# Altium project Nebula_1.7OLED.PrjPcb
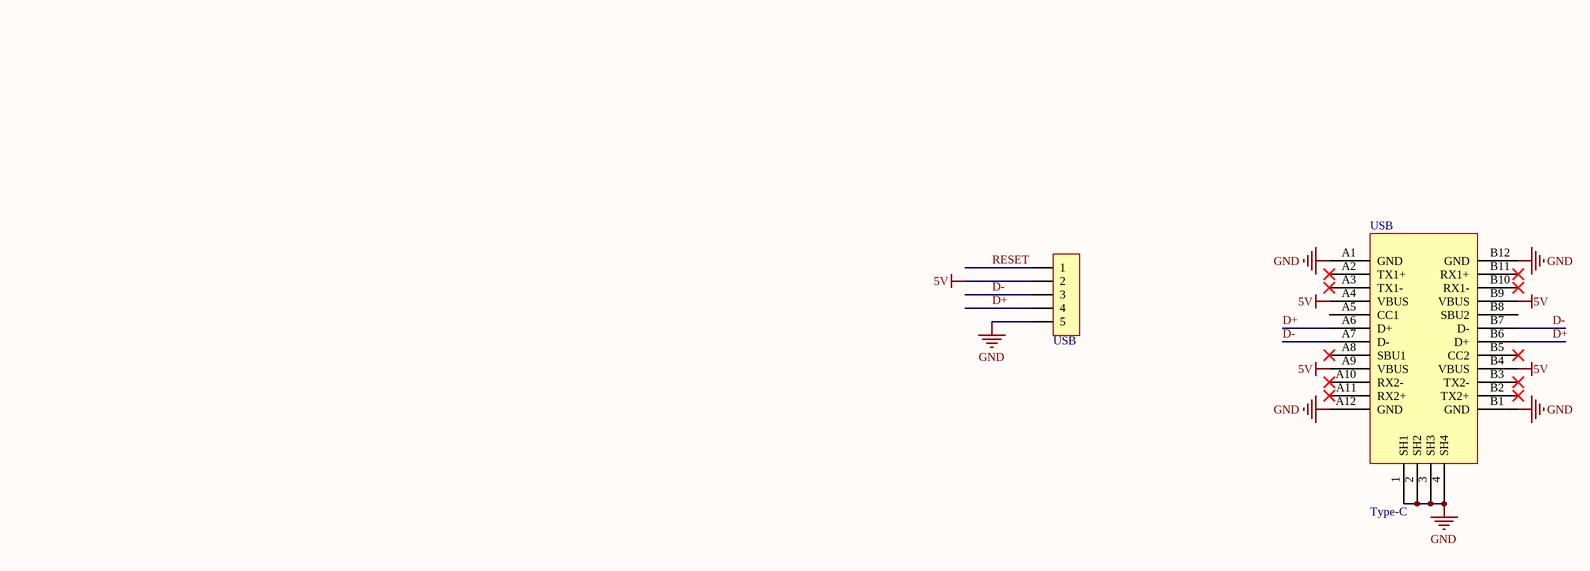
[diagram p0: USB Typec.SchDoc]
2 sheets, 38 parts. Net scope: global (net labels, ports and power ports of the same name join across sheets).
Board file: Nebula_1.7OLED.PcbDoc
Sheets:
  USB Typec.SchDoc
  Nebula_1.7OLED.SchDoc

## Sheet USB Typec.SchDoc
size A3; DocumentNumber: 1; SheetNumber: 1; SheetTotal: 2

### Parts
(Parts that share a designator on the sheet are numbered #1, #2 ... from top to bottom, then left to right.)
USB#1  HDR-1X5  [ZH1.5-LS-5P]  (value not drawn)
USB#2  Type-C  [Type-C]

### Nets
5V: USB#1.2 USB#2.A4(VBUS) USB#2.A9(VBUS) USB#2.B4(VBUS) USB#2.B9(VBUS)
GND: USB#1.5 USB#2.1(SH1) USB#2.2(SH2) USB#2.3(SH3) USB#2.4(SH4) USB#2.A1(GND) USB#2.A12(GND) USB#2.B1(GND) USB#2.B12(GND)
D+: USB#1.4 USB#2.A6(D+) USB#2.B6(D+)
D-: USB#1.3 USB#2.A7(D-) USB#2.B7(D-)
RESET: USB#1.1  [project net NRST]

Not connected (* = marked no-connect by the designer): USB#2 A2(TX1+)* A3(TX1-)* A5(CC1) A8(SBU1)* A10(RX2-)* A11(RX2+)* B2(TX2+)* B3(TX2-)* B5(CC2)* B8(SBU2) B10(RX1-)* B11(RX1+)*

### Library data of the parts
USB#1 = Header 5: 5P接插件; 版权归属: 源创客; BOM名称: 5P接插件; 学习资源: www.ooocke.com

## Sheet Nebula_1.7OLED.SchDoc
size A3; DocumentNumber: 1; SheetNumber: 1; SheetTotal: 1
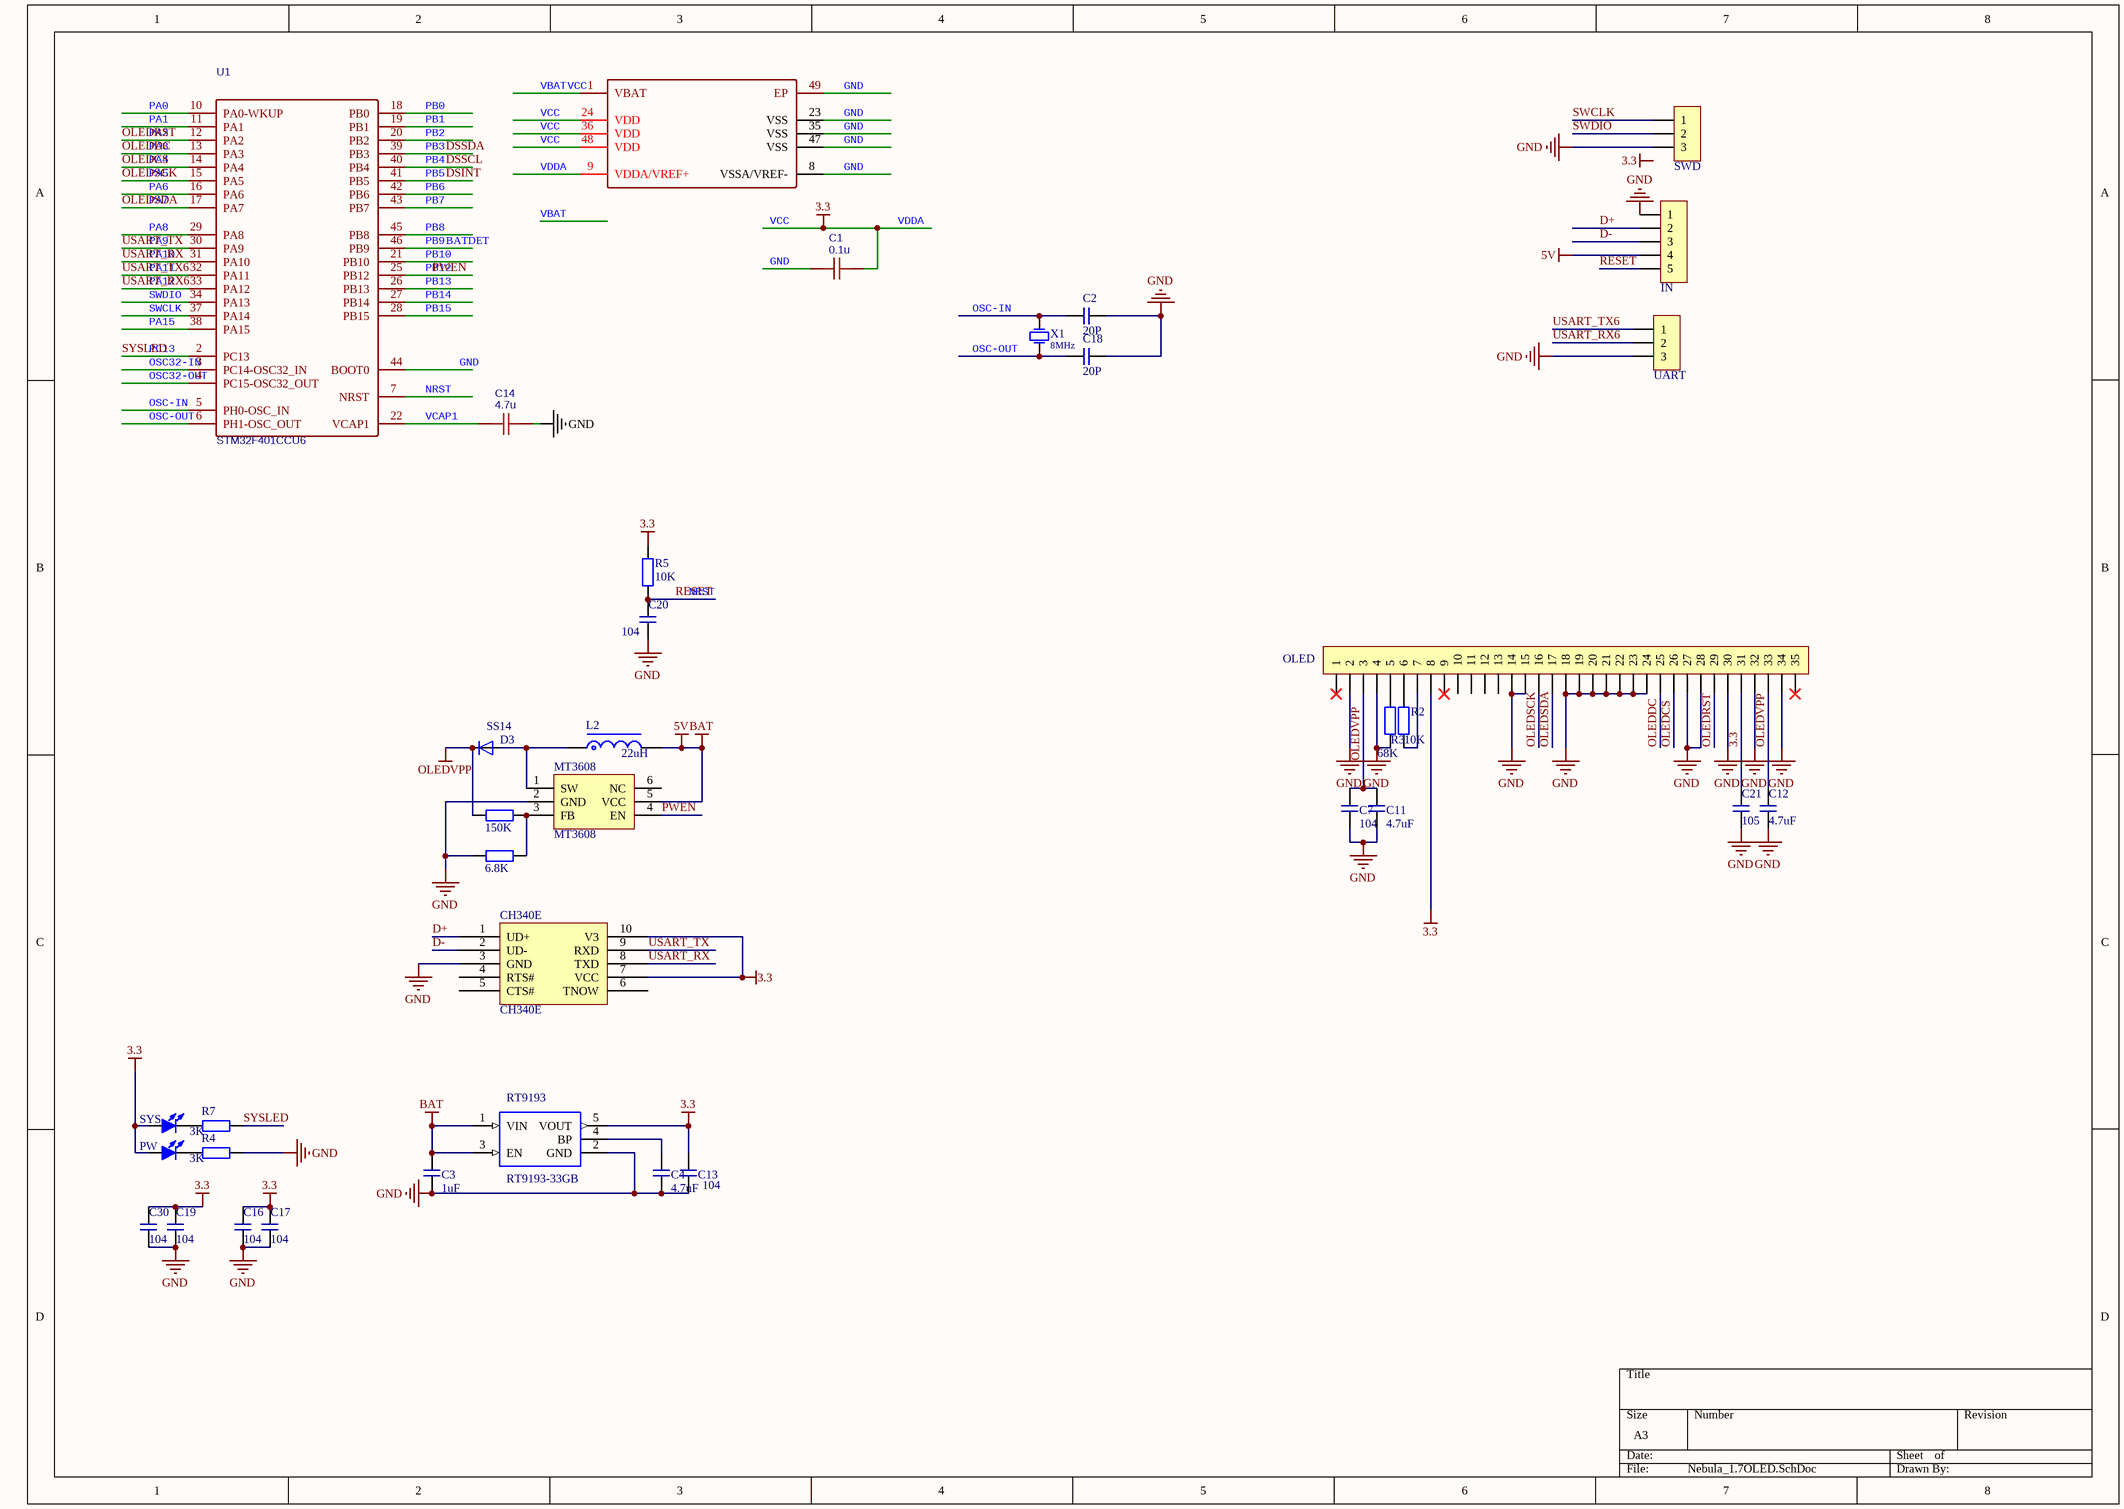
[diagram p1: Nebula_1.7OLED.SchDoc]

### Parts
C1  0.1u  [0603C]
C2  20P  [0603C]
C3  1uF  [0603C]
C4  4.7uF  [0603C]
C7  104  [0603C]
C11  4.7uF  [0603C]
C12  4.7uF  [0603C]
C13  104  [0603C]
C14  4.7u  [0603C]
C16  104  [0603C]
C17  104  [0603C]
C18  20P  [0603C]
C19  104  [0603C]
C20  104  [0603C]
C21  105  [0603C]
C30  104  [0603C]
CH340E  CH340E  [MSOP10_L]
D3  SS14  [SOD323_1N4148WS]
IN  HDR-1X5  [ZH1.5-LS-5P]  (value not drawn)
L2  22uH  [1210-ec]
MT3608  MT3608  [SOT23-6N]
OLED  FPC1.0-35P  [1.69 OLED]  (value not drawn)
PW  白色  [0603LED]  (value not drawn)
R2  10K  [0603R]
R3  68K  [0603R]
R4  3K  [0603R]
R5  10K  [0603R]
R7  3K  [0603R]
RB  150K  [0603R]
RS  6.8K  [0603R]
RT9193  RT9193-33GB  [sot23-5]
SWD  HDR-1X3  [ZH1.5-LS-3P]  (value not drawn)
SYS  粉色  [0603LED]  (value not drawn)
U1  STM32F401CCU6  [QFN48 7X7_N]
UART  HDR-1X3  [ZH1.5-LS-3P]  (value not drawn)
X1  value 8MHz  [OSC 5032-2P]  (hidden comment: 1.6.1.01.005.001)

### Nets
3.3: C1.1 C13.2 C16.1 C17.1 C19.1 C21.1 C30.1 CH340E.7(VCC) CH340E.10(V3) OLED.8 OLED.31 PW.1(A) R5.1 RT9193.5(VOUT) SYS.1(A) U1.1(VBAT) U1.9(VDDA/VREF+) U1.24(VDD) U1.36(VDD) U1.48(VDD)  [also labelled VBAT, VCC, VDDA]
5V: C3.2 IN.4 L2.2 MT3608.5(VCC) RT9193.1(VIN) RT9193.3(EN)  [also labelled BAT]
GND: C1.2 C2.1 C3.1 C4.1 C7.2 C11.2 C12.2 C13.1 C14.2 C16.2 C17.2 C18.1 C19.2 C20.2 C21.2 C30.2 CH340E.3(GND) IN.1 MT3608.2(GND) OLED.2 OLED.4 OLED.14 OLED.15 OLED.18 OLED.19 OLED.20 OLED.21 OLED.22 OLED.23 OLED.24 OLED.27 OLED.28 OLED.30 OLED.32 OLED.34 R3.1 R4.1 RS.1 RT9193.2(GND) SWD.3 U1.8(VSSA/VREF-) U1.23(VSS) U1.35(VSS) U1.44(BOOT0) U1.47(VSS) U1.49(EP) UART.3
OLEDVPP: C7.1 C11.1 C12.1 D3.C OLED.3 OLED.33 RB.1
BATDET: U1.46(PB9)  [also labelled PB9]
D+: CH340E.1(UD+) IN.2
D-: CH340E.2(UD-) IN.3
DSINT: U1.41(PB5)  [also labelled PB5]
DSSCL: U1.40(PB4)  [also labelled PB4]
DSSDA: U1.39(PB3)  [also labelled PB3]
NRST: C20.1 IN.5 R5.2 U1.7(NRST)  [also labelled RESET]
OLEDCS: OLED.26 U1.14(PA4)  [also labelled PA4]
OLEDDC: OLED.25 U1.13(PA3)  [also labelled PA3]
OLEDRST: OLED.29 U1.12(PA2)  [also labelled PA2]
OLEDSCK: OLED.16 U1.15(PA5)  [also labelled PA5]
OLEDSDA: OLED.17 U1.17(PA7)  [also labelled PA7]
OSC32-IN: U1.3(PC14-OSC32_IN)
OSC32-OUT: U1.4(PC15-OSC32_OUT)
OSC-IN: C2.2 U1.5(PH0-OSC_IN) X1.1(OSC1)
OSC-OUT: C18.2 U1.6(PH1-OSC_OUT) X1.2(OSC2)
PA0: U1.10(PA0-WKUP)
PA1: U1.11(PA1)
PA6: U1.16(PA6)
PA8: U1.29(PA8)
PA9: CH340E.9(RXD) U1.30(PA9)  [also labelled USART_TX]
PA10: CH340E.8(TXD) U1.31(PA10)  [also labelled USART_RX]
PA11: U1.32(PA11) UART.1  [also labelled USART_TX6]
PA12: U1.33(PA12) UART.2  [also labelled USART_RX6]
PA15: U1.38(PA15)
PB0: U1.18(PB0)
PB1: U1.19(PB1)
PB2: U1.20(PB2)
PB6: U1.42(PB6)
PB7: U1.43(PB7)
PB8: U1.45(PB8)
PB10: U1.21(PB10)
PB12: MT3608.4(EN) U1.25(PB12)  [also labelled PWEN]
PB13: U1.26(PB13)
PB14: U1.27(PB14)
PB15: U1.28(PB15)
PC13: R7.1 U1.2(PC13)  [also labelled SYSLED]
SWCLK: SWD.1 U1.37(PA14)
SWDIO: SWD.2 U1.34(PA13)
VCAP1: C14.1 U1.22(VCAP1)
NetC4_2: C4.2 RT9193.4(BP)
NetD3_A: D3.A L2.1 MT3608.1(SW)
NetMT3608_3: MT3608.3(FB) RB.2 RS.2
NetOLED_5: OLED.5 R3.2
NetOLED_6: OLED.6 R2.2
NetOLED_7: OLED.7 R2.1
NetPW_2: PW.2(K) R4.2
NetR7_2: R7.2 SYS.2(K)

Not connected (* = marked no-connect by the designer): CH340E 4(RTS#) 5(CTS#) 6(TNOW); MT3608 6(NC); OLED 1* 9* 10 11 12 13 35*

### Notes on the sheet
- Labels drawn without touching a wire or pin: 3.3

### Library data of the parts
C1 = 0.1u: nameAlias: Value(F); Contributor: LCEDA_Lib; spicePre: C; spiceSymbolName: C_0402_US
C2-C4 C7 C11-C13 C16-C21 C30 = 电容
C14 = 4.7u: nameAlias: Value(F); Contributor: LCEDA_Lib; spicePre: C; spiceSymbolName: C_0402_US
D3 = 1N4148WS: Diode Switching 75V 0.3A 2-Pin SOD-323 T/R; MF: ON Semiconductor; SnapEDA_Link: https://www.snapeda.com/parts/1N4148WS/ON%20Semiconductor/view-part/?ref=snap; Price: None; Availability: Unavailable; MP: 1N4148WS; Package: S-0 Good-Ark; Value: *
IN = Header 5: 5P接插件; 版权归属: 源创客; BOM名称: 5P接插件; 学习资源: www.ooocke.com
L2 = L-CDRH: 功率屏蔽电感; 版权归属: 源创客; BOM名称: 功率屏蔽电感; 学习资源: www.ooocke.com
MT3608 = SX1308: 可调升压芯片; 版权归属: 源创客; BOM名称: 可调升压芯片; 学习资源: www.ooocke.com
OLED = FPC-35P: FPC连接器; 版权归属: 源创客; BOM名称: FPC连接器; 学习资源: www.ooocke.com
PW SYS = LED-F234: 方形LED; 版权归属: 源创客; BOM名称: 方形LED; 学习资源: www.ooocke.com
R2-R5 R7 RB RS = R: 贴片电阻; 版权归属: 源创客; BOM名称: 贴片电阻; 学习资源: www.ooocke.com
RT9193 = RT9193-33GB: RT9193 Series 300 mA 3.3 V Ultra-Low Noise Ultra-Fast CMOS LDO Regulator-SC-70-5; MF: Richtek USA; SnapEDA_Link: https://www.snapeda.com/parts/RT9193-33GB/Richtek%20USA%20Inc./view-part/?ref=snap; Price: None; Availability: Unavailable; Package: SOT-23-5 Richtek; MP: RT9193-33GB; Value: *
SWD UART = Header 3: 3P接插件; 版权归属: 源创客; BOM名称: 3P接插件; 学习资源: www.ooocke.com
U1 = STM32F401CCU6: BOM_Manufacturer: ST; subpart_no: 1; tags: STM32; BOM_Supplier Part: C79861; BOM_Supplier: LCSC; BOM_Manufacturer Part: STM32F401CCU6; spicePre: U; spiceSymbolName: STM32F401CCU6
X1 = 1.6.1.01.005.001: XTAL,8MHz,±20PPM,12.6*4.5; K3 No.: 1.6.1.01.005.001; GENERAL: *

## Nets that join several sheets
5V: USB Typec (5 pins), Nebula_1.7OLED (6 pins)
GND: USB Typec (9 pins), Nebula_1.7OLED (47 pins)
D+: USB Typec (USB#1.4 USB#2.A6 USB#2.B6), Nebula_1.7OLED (CH340E.1 IN.2)
D-: USB Typec (USB#1.3 USB#2.A7 USB#2.B7), Nebula_1.7OLED (CH340E.2 IN.3)
NRST: USB Typec (USB#1.1), Nebula_1.7OLED (C20.1 IN.5 R5.2 U1.7)